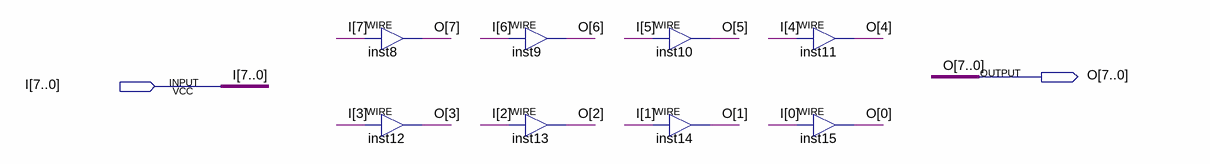
[diagram p0: schematic sheet]
// Quartus schematic buffer8bit.bdf as structural Verilog: 8 symbols, 2 pins
module buffer8bit (
  input  [7:0] I,
  output [7:0] O
);

  assign O[7] = I[7];  // WIRE inst8
  assign O[3] = I[3];  // WIRE inst12
  assign O[6] = I[6];  // WIRE inst9
  assign O[2] = I[2];  // WIRE inst13
  assign O[5] = I[5];  // WIRE inst10
  assign O[1] = I[1];  // WIRE inst14
  assign O[4] = I[4];  // WIRE inst11
  assign O[0] = I[0];  // WIRE inst15
endmodule
